# EAGLE design Edzzanine_Base (EAGLE 6.5.0)

## Sheet 1 of 2
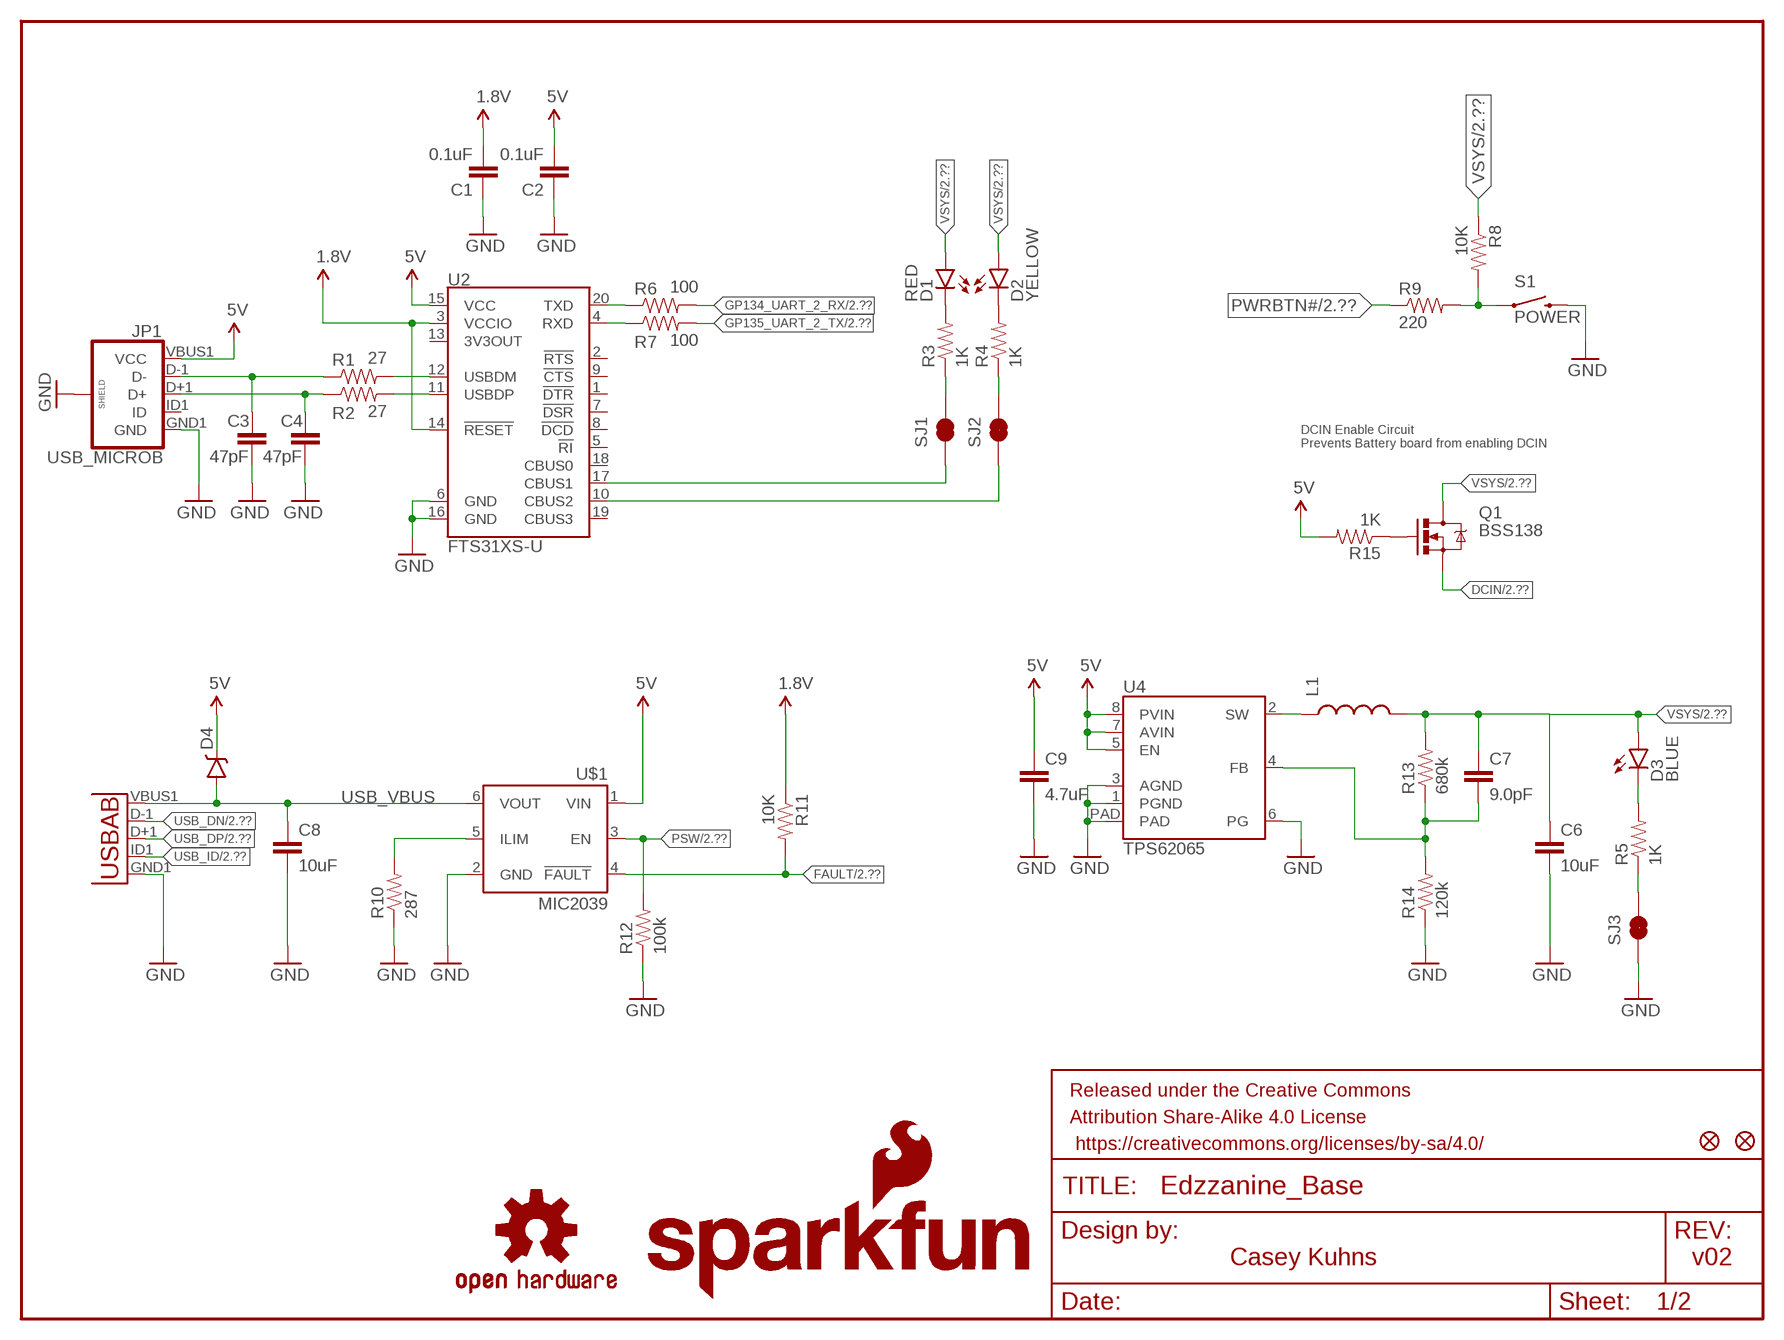
[diagram p0: schematic, sheet 1]

### Parts
C1  0.1uF  0.1UF-25V(+80/-20%)(0603)  [0603-CAP]
C2  0.1uF  0.1UF-25V(+80/-20%)(0603)  [0603-CAP]
C3  47pF  47PF-50V-5%(0603)  [0603-CAP]
C4  47pF  47PF-50V-5%(0603)  [0603-CAP]
C6  10uF  10UF-6.3V-20%(1206)  [1206]
C7  9.0pF  9.0PF-50V-10%(0603)  [0603-CAP]
C8  10uF  10UF-6.3V-20%(1206)  [1206]
C9  4.7uF  4.7UF-6.3V-10%(0603)0603  [0603-CAP]
D1  RED  LED-RED0603  [LED-0603]
D2  YELLOW  LED-YELLOW0603  [LED-0603]
D3  BLUE  LED-BLUE0603  [LED-0603]
D4  DIODE-SCHOTTKY-MBRA140  [SMA-DIODE]
FID1  FIDUCIAL1X2  [FIDUCIAL-1X2]
FID2  FIDUCIAL1X2  [FIDUCIAL-1X2]
FRAME1  FRAME-LETTER  [CREATIVE_COMMONS]
JP1  USB_MICROB  USB_MICROB_PLUGCONN-11752  [USB-B-MICRO-SMD_V03]
L1  INDUCTOR  [INDUCTOR-SRP4020]
LOGO1  SFE_LOGO_NAME_FLAME.1_INCH  [SFE_LOGO_NAME_FLAME_.1]
LOGO4  OSHW-LOGOS  [OSHW-LOGO-S]
Q1  BSS138  MOSFET-NCHANNELBSS138  [SOT23-3]
R1  27  27OHM1/10W1%(0603)  [0603]
R2  27  27OHM1/10W1%(0603)  [0603]
R3  1K  1KOHM1/10W1%(0603)  [0603-RES]
R4  1K  1KOHM1/10W1%(0603)  [0603-RES]
R5  1K  1KOHM1/10W1%(0603)  [0603-RES]
R6  100  100OHM1/10W1%(0603)  [0603-RES]
R7  100  100OHM1/10W1%(0603)  [0603-RES]
R8  10K  10KOHM1/10W1%(0603)0603  [0603-RES]
R9  220  22OHM1/10W1%(0603)  [0603-RES]
R10  287  287OHM-1/10W-1%(0603)  [0603-RES]
R11  10K  10KOHM1/10W1%(0603)0603  [0603-RES]
R12  100k  100KOHM1/10W1%(0603)  [0603-RES]
R13  680k  RESISTOR0603  [0603-RES]
R14  120k  RESISTOR0603  [0603-RES]
R15  1K  1KOHM1/10W1%(0603)  [0603-RES]
S1  POWER  SWITCH-MOMENTARY-2TACTILE-SWITCH-SMD-RIGHT-ANGLE  [TACTILE_SWITCH-SMD-RIGHT-ANGLE]
SJ1  JUMPER-PAD-2-NC_BY_TRACE  [PAD-JUMPER-2-NC_BY_TRACE_YES_SILK]
SJ2  JUMPER-PAD-2-NC_BY_TRACE  [PAD-JUMPER-2-NC_BY_TRACE_YES_SILK]
SJ3  JUMPER-PAD-2-NC_BY_TRACE  [PAD-JUMPER-2-NC_BY_TRACE_YES_SILK]
U2  FTS31XS-U  FT231XS  [SSOP20_L]
U3  USB-ABCONN-11794  [USB-AB-MICRO-SMD_V03]
U4  TPS62065  [WSON-8-PAD]
U$1  MIC2039  [SOT23-6]

### Nets
1.8V: C1.2 R11.1 U2.3(VCCIO) U2.14(!RESET) ; also sheet 2
5V: C2.2 C9.1 D4.C JP1.VBUS1(VCC) R15.2 U2.15(VCC) U4.5(EN) U4.7(AVIN) U4.8(PVIN) U$1.1(VIN)
DCIN: Q1.2(S) ; also sheet 2
FAULT: R11.2 U$1.4(!FAULT) ; also sheet 2
GND: C1.1 C2.1 C3.2 C4.2 C6.2 C8.2 C9.2 JP1.GND1(GND) JP1.SHIELD1(SHIELD) JP1.SHIELD2(SHIELD) JP1.SHIELD3(SHIELD) R10.1 R12.1 R14.1 S1.2 SJ3.1 U2.6(GND) U2.16(GND) U3.GND1(GND) U4.1(PGND) U4.3(AGND) U4.6(PG) U4.PAD U$1.2(GND) ; also sheet 2
GP134_UART_2_RX: R6.2 ; also sheet 2
GP135_UART_2_TX: R7.2 ; also sheet 2
N$1: SJ1.1 U2.17(CBUS1)
N$2: C3.1 JP1.D-1(D-) R1.1
N$3: C4.1 JP1.D+1(D+) R2.1
N$4: R1.2 U2.12(USBDM)
N$5: R2.2 U2.11(USBDP)
N$6: SJ2.1 U2.10(CBUS2)
N$7: R3.1 SJ1.2
N$8: R4.1 SJ2.2
N$9: D1.C R3.2
N$10: D2.C R4.2
N$11: R6.1 U2.20(TXD)
N$12: D3.C R5.2
N$13: R5.1 SJ3.2
N$14: R7.1 U2.4(RXD)
N$15: R8.2 R9.2 S1.1
N$16: R10.2 U$1.5(ILIM)
N$17: C7.2 R13.1 R14.2 U4.4(FB)
N$18: Q1.1(G) R15.1
N$19: L1.P$1 U4.2(SW)
PSW: R12.2 U$1.3(EN) ; also sheet 2
PWRBTN#: R9.1 ; also sheet 2
USB_DN: U3.D-1(D-) ; also sheet 2
USB_DP: U3.D+1(D+) ; also sheet 2
USB_ID: U3.ID1(USBID) ; also sheet 2
USB_VBUS: C8.1 D4.A U3.VBUS1(VBUS) U$1.6(VOUT) ; also sheet 2
VSYS: C6.1 C7.1 D1.A D2.A D3.A L1.P$2 Q1.3(D) R8.1 R13.2 ; also sheet 2
Unconnected: JP1.ID1(ID) U2.1(!DTR) U2.2(!RTS) U2.5(!RI) U2.7(!DSR) U2.8(!DCD) U2.9(!CTS) U2.13(3V3OUT) U2.18(CBUS0) U2.19(CBUS3)

### Notes on the sheet
- DCIN Enable Circuit
  Prevents Battery board from enabling DCIN
- Casey Kuhns | v02

## Sheet 2 of 2
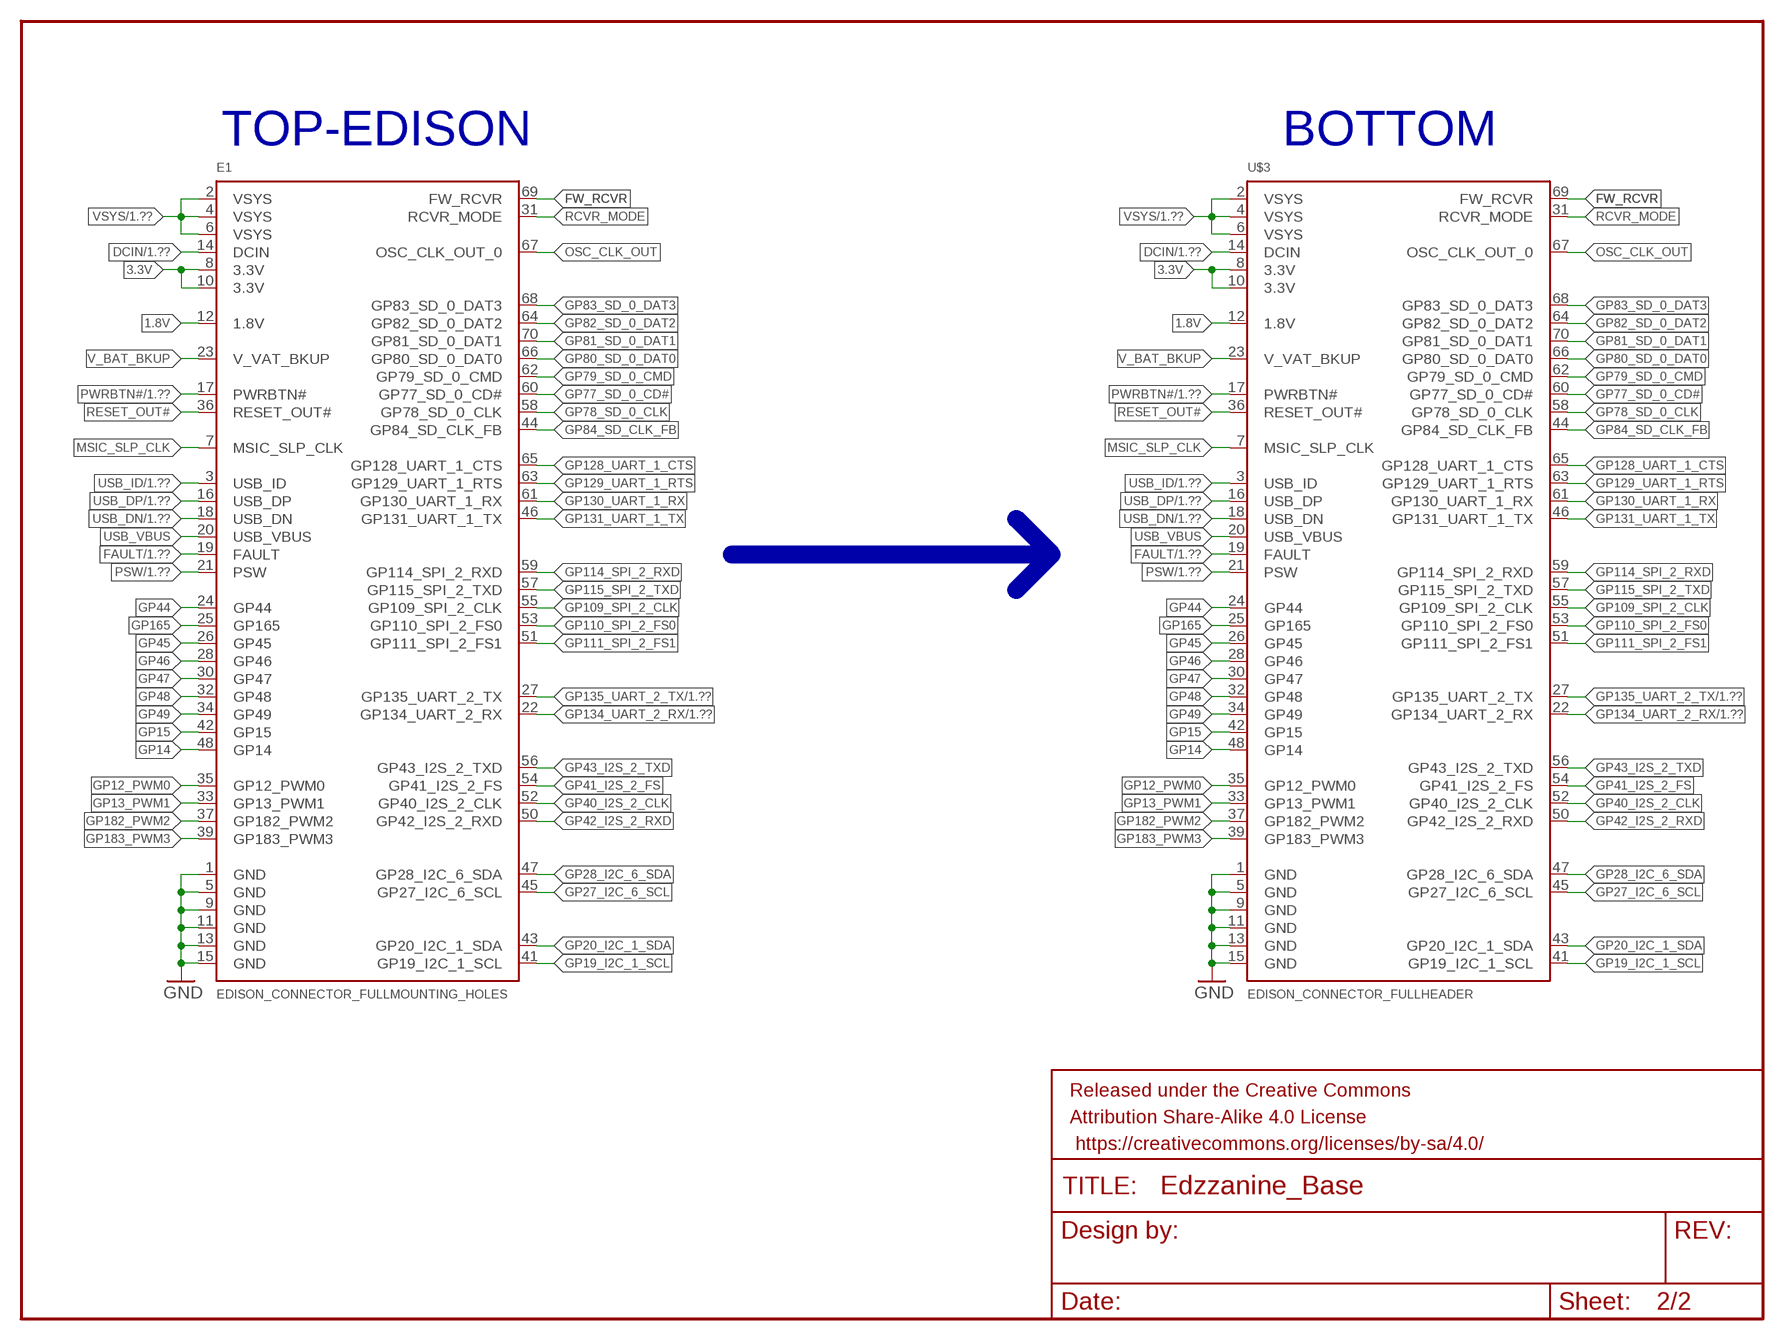
[diagram p1: schematic, sheet 2]

### Parts
E1  EDISON_CONNECTOR_FULLMOUNTING_HOLES  [EDISON_DAUGHTER]
FRAME2  FRAME-LETTER  [CREATIVE_COMMONS]
U$3  EDISON_CONNECTOR_FULLHEADER  [DF40C-70DP-0.4(51)]

### Nets
1.8V: E1.12(1.8V) U$3.12(1.8V) ; also sheet 1
3.3V: E1.8(3.3V) E1.10(3.3V) U$3.8(3.3V) U$3.10(3.3V)
DCIN: E1.14(DCIN) U$3.14(DCIN) ; also sheet 1
FAULT: E1.19(FAULT) U$3.19(FAULT) ; also sheet 1
FW_RCVR: E1.69(FW_RCVR) U$3.69(FW_RCVR)
GND: E1.1(GND) E1.5(GND) E1.9(GND) E1.11(GND) E1.13(GND) E1.15(GND) U$3.1(GND) U$3.5(GND) U$3.9(GND) U$3.11(GND) U$3.13(GND) U$3.15(GND) ; also sheet 1
GP12_PWM0: E1.35(GP12_PWM0) U$3.35(GP12_PWM0)
GP13_PWM1: E1.33(GP13_PWM1) U$3.33(GP13_PWM1)
GP14: E1.48(GP14) U$3.48(GP14)
GP15: E1.42(GP15) U$3.42(GP15)
GP19_I2C_1_SCL: E1.41(GP19_I2C_1_SCL) U$3.41(GP19_I2C_1_SCL)
GP20_I2C_1_SDA: E1.43(GP20_I2C_1_SDA) U$3.43(GP20_I2C_1_SDA)
GP27_I2C_6_SCL: E1.45(GP27_I2C_6_SCL) U$3.45(GP27_I2C_6_SCL)
GP28_I2C_6_SDA: E1.47(GP28_I2C_6_SDA) U$3.47(GP28_I2C_6_SDA)
GP40_I2S_2_CLK: E1.52(GP40_I2S_2_CLK) U$3.52(GP40_I2S_2_CLK)
GP41_I2S_2_FS: E1.54(GP41_I2S_2_FS) U$3.54(GP41_I2S_2_FS)
GP42_I2S_2_RXD: E1.50(GP42_I2S_2_RXD) U$3.50(GP42_I2S_2_RXD)
GP43_I2S_2_TXD: E1.56(GP43_I2S_2_TXD) U$3.56(GP43_I2S_2_TXD)
GP44: E1.24(GP44) U$3.24(GP44)
GP45: E1.26(GP45) U$3.26(GP45)
GP46: E1.28(GP46) U$3.28(GP46)
GP47: E1.30(GP47) U$3.30(GP47)
GP48: E1.32(GP48) U$3.32(GP48)
GP49: E1.34(GP49) U$3.34(GP49)
GP77_SD_0_CD#: E1.60(GP77_SD_0_CD#) U$3.60(GP77_SD_0_CD#)
GP78_SD_0_CLK: E1.58(GP78_SD_0_CLK) U$3.58(GP78_SD_0_CLK)
GP79_SD_0_CMD: E1.62(GP79_SD_0_CMD) U$3.62(GP79_SD_0_CMD)
GP80_SD_0_DAT0: E1.66(GP80_SD_0_DAT0) U$3.66(GP80_SD_0_DAT0)
GP81_SD_0_DAT1: E1.70(GP81_SD_0_DAT1) U$3.70(GP81_SD_0_DAT1)
GP82_SD_0_DAT2: E1.64(GP82_SD_0_DAT2) U$3.64(GP82_SD_0_DAT2)
GP83_SD_0_DAT3: E1.68(GP83_SD_0_DAT3) U$3.68(GP83_SD_0_DAT3)
GP84_SD_CLK_FB: E1.44(GP84_SD_CLK_FB) U$3.44(GP84_SD_CLK_FB)
GP109_SPI_2_CLK: E1.55(GP109_SPI_2_CLK) U$3.55(GP109_SPI_2_CLK)
GP110_SPI_2_FS0: E1.53(GP110_SPI_2_FS0) U$3.53(GP110_SPI_2_FS0)
GP111_SPI_2_FS1: E1.51(GP111_SPI_2_FS1) U$3.51(GP111_SPI_2_FS1)
GP114_SPI_2_RXD: E1.59(GP114_SPI_2_RXD) U$3.59(GP114_SPI_2_RXD)
GP115_SPI_2_TXD: E1.57(GP115_SPI_2_TXD) U$3.57(GP115_SPI_2_TXD)
GP128_UART_1_CTS: E1.65(GP128_UART_1_CTS) U$3.65(GP128_UART_1_CTS)
GP129_UART_1_RTS: E1.63(GP129_UART_1_RTS) U$3.63(GP129_UART_1_RTS)
GP130_UART_1_RX: E1.61(GP130_UART_1_RX) U$3.61(GP130_UART_1_RX)
GP131_UART_1_TX: E1.46(GP131_UART_1_TX) U$3.46(GP131_UART_1_TX)
GP134_UART_2_RX: E1.22(GP134_UART_2_RX) U$3.22(GP134_UART_2_RX) ; also sheet 1
GP135_UART_2_TX: E1.27(GP135_UART_2_TX) U$3.27(GP135_UART_2_TX) ; also sheet 1
GP165: E1.25(GP165) U$3.25(GP165)
GP182_PWM2: E1.37(GP182_PWM2) U$3.37(GP182_PWM2)
GP183_PWM3: E1.39(GP183_PWM3) U$3.39(GP183_PWM3)
MSIC_SLP_CLK: E1.7(MSIC_SLP_CLK) U$3.7(MSIC_SLP_CLK)
OSC_CLK_OUT: E1.67(OSC_CLK_OUT_0) U$3.67(OSC_CLK_OUT_0)
PSW: E1.21(PSW) U$3.21(PSW) ; also sheet 1
PWRBTN#: E1.17(PWRBTN#) U$3.17(PWRBTN#) ; also sheet 1
RCVR_MODE: E1.31(RCVR_MODE) U$3.31(RCVR_MODE)
RESET_OUT#: E1.36(RESET_OUT#) U$3.36(RESET_OUT#)
USB_DN: E1.18(USB_DN) U$3.18(USB_DN) ; also sheet 1
USB_DP: E1.16(USB_DP) U$3.16(USB_DP) ; also sheet 1
USB_ID: E1.3(USB_ID) U$3.3(USB_ID) ; also sheet 1
USB_VBUS: E1.20(USB_VBUS) U$3.20(USB_VBUS) ; also sheet 1
V_BAT_BKUP: E1.23(V_VAT_BKUP) U$3.23(V_VAT_BKUP)
VSYS: E1.2(VSYS) E1.4(VSYS) E1.6(VSYS) U$3.2(VSYS) U$3.4(VSYS) U$3.6(VSYS) ; also sheet 1

### Buses
B$1

### Notes on the sheet
- TOP-EDISON | BOTTOM

## Library data of the parts
C1 C2 = SparkFun-Capacitors:0.1UF-25V(+80/-20%)(0603): CAP-00810 Ceramic Standard decoupling cap; PROD_ID: CAP-00810
C3 C4 = SparkFun-Capacitors:47PF-50V-5%(0603): CAP-08913; PROD_ID: CAP-08913
C6 C8 = SparkFun-Capacitors:10UF-6.3V-20%(1206): CAP-10057 Ceramic; PROD_ID: CAP-10057
C7 = SparkFun-Capacitors:9.0PF-50V-10%(0603): CAP-09341; PROD_ID: CAP-09341
C9 = SparkFun-Capacitors:4.7UF-6.3V-10%(0603): CAP-08280; PROD_ID: CAP-08280
D1 = SparkFun-LED:LED-RED: Assorted Red LEDs LilyPad 1206- DIO-09912 1206- DIO-00809 0603- DIO-00819; PROD_ID: DIO-00819
D2 = SparkFun-LED:LED-YELLOW: Yellow SMD LEDs LilyPad 1206- DIO-09909 0603- DIO-09003; PROD_ID: DIO-09003
D3 = SparkFun-LED:LED-BLUE: Blue LEDs for production use Various blue LEDs stocked by SparkFun production 0603 - DIO-08575 Rebel - DIO-09553 1206 - DIO-09911; PROD_ID: DIO-08575
D4 = SparkFun-DiscreteSemi:DIODE-SCHOTTKY: Schottky diodes in SFE's production catalog BAT20J 1A 23V 0.62Vf RB751 120mA 40V 0.37Vf PMEG4005EJ 0.5A 40V 0.42Vf MBRA140 1A 40V 0.5Vf B340A 3A 40V SMA; PROD_ID: DIO-08053; VALUE: MBRA140
E1 U$3 = Edison:EDISON_CONNECTOR_FULL
FID1 FID2 = SparkFun-Aesthetics:FIDUCIAL: Fiducial Alignment Points Various fiducial points for machine vision alignment.
FRAME1 FRAME2 = SparkFun-Aesthetics:FRAME-LETTER: Schematic Frame Standard 8.5x11 US Letter frame
JP1 = SparkFun-Connectors:USB_MICROB_PLUG: USB Micro-B connectors Some male, some female. Watch your step!; PROD_ID: CONN-11752
L1 = SparkFun-Passives:INDUCTOR: Inductors Basic Inductor/Choke - 0603 and 1206. Footprints are not proven and vary greatly between part numbers. SRN6045- 33uH, 20% 1.4A SDR0403-560KL - 56uH, 10%, 500mA RMS/740mA peak
LOGO1 = SparkFun-Aesthetics:SFE_LOGO_NAME_FLAME: SFE Logo, name and flame This is the SparkFun full logo. The logo on the schematic will always be the same size; the package variant is the height of the flame part of the logo. Default layer for the logo on the board is tSilk.
LOGO4 = SparkFun-Aesthetics:OSHW-LOGO: Open Source Hardware Logo This logo indicates the piece of hardware it is found on incorporates a OSHW license and/or adheres to the definition of open source hardware found here: http://freedomdefined.org/OSHW
Q1 = SparkFun-DiscreteSemi:MOSFET-NCHANNEL: Common NMOSFET Parts MFG P/N Store ID Prod ID FDD8780 TRANS-09984 SI7820DN TRANS-11055 FDS6630A IC-08089 2N7002PW TRANS-11151 FQP30N06L COM-10213 TRANS-10060 BSS123LT1G TRANS-08345 BSS138 TRANS-00830 BS170 2N7000; PROD_ID: TRANS-00830
R1 R2 = SparkFun-Resistors:27OHM1/10W1%(0603): RES-09334; PROD_ID: RES-09334
R3-R5 R15 = SparkFun-Resistors:1KOHM1/10W1%(0603): RES-07856; PROD_ID: RES-07856
R6 R7 = SparkFun-Resistors:100OHM1/10W1%(0603): RES-07863; PROD_ID: RES-07863
R8 R11 = SparkFun-Resistors:10KOHM1/10W1%(0603): RES-00824; PROD_ID: RES-00824
R9 = SparkFun-Resistors:22OHM1/10W1%(0603): RES-08698; PROD_ID: RES-08698; VALUE: 22
R10 = SparkFun-Resistors:287OHM-1/10W-1%(0603): RES-10752; PROD_ID: RES-10752
R12 = SparkFun-Resistors:100KOHM1/10W1%(0603): RES-07828; PROD_ID: RES-07828
R13 R14 = SparkFun-Resistors:RESISTOR: Resistor Basic schematic elements and footprints for 0603, 1206, and PTH resistors.
S1 = SparkFun-Electromechanical:SWITCH-MOMENTARY-2: Various NO switches- pushbuttons, reed, etc; PROD_ID: COMP-12265
SJ1-SJ3 = SparkFun-Passives:JUMPER-PAD-2-NC_BY_TRACE
U2 = SparkFun-DigitalIC:FT231X: FTDI FT231X Full Speed USB to Full-handshake UART This USB2.0 Full Speed IC offers a compact bridge to full handshake UART interfaces. The device is a UART, capable of operating up to 3MBaud, with low power consumption (8mA). The FT231X includes the complete FT-X series feature set and enables USB to be added into a system design quickly and easily over a UART interface.; PROD_ID: IC-11524
U3 = SparkFun-Connectors:USB-AB: This is a USB AB connector that is compatible with USB OTG. i.e. this connector can serve as a host or device; PROD_ID: CONN-11794
U4 = Testing:TPS62065: Texas Instruments TPS62172 3-17V 0.5A Step-Down Converter with DCS control. Available in adjustable and fixed output voltage versions. Is packaged in an 8-pin WSON package measuring 2 × 2 mm (DSG). See a 3.3V fixed output version of this chip in action on the Electric Imp Breakout Board <https://www.sparkfun.com/products/11400>. Datasheet <http://www.ti.com/lit/gpn/tps62172>
U$1 = Testing:MIC2039

## Board
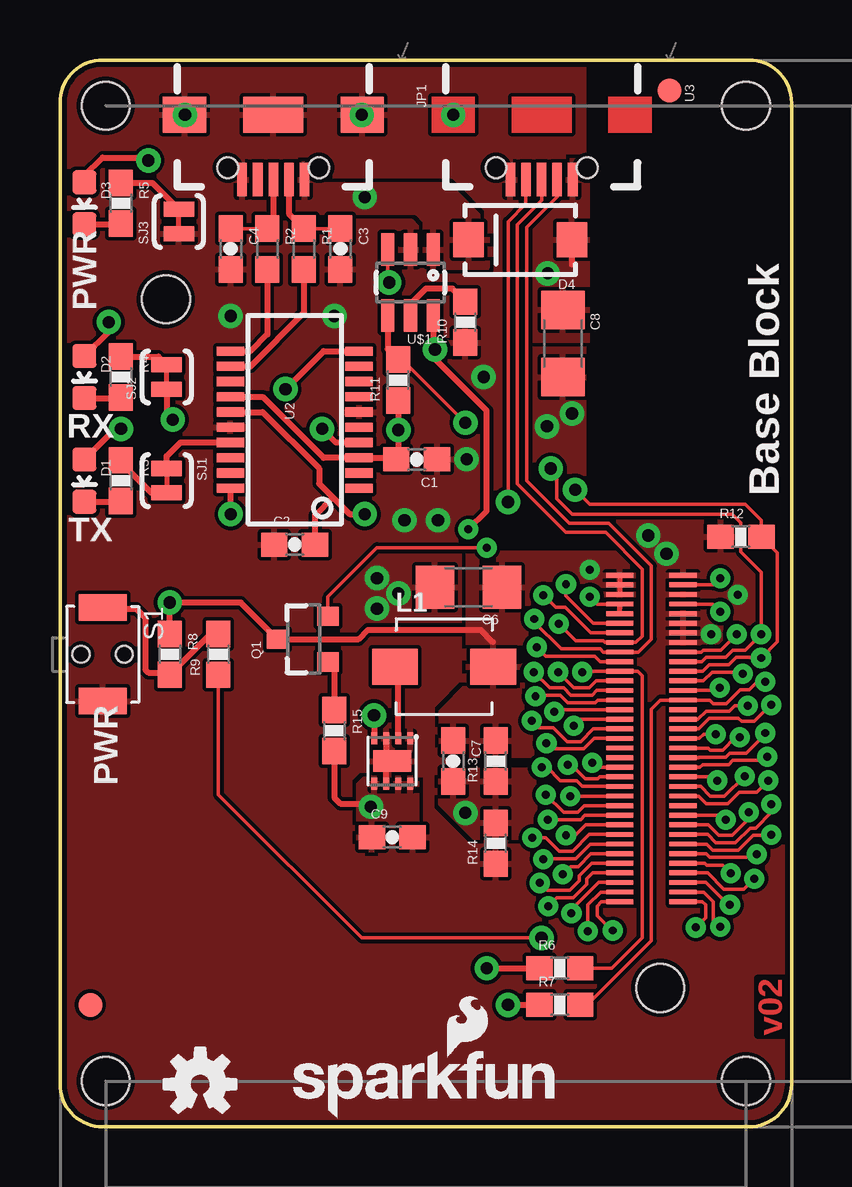
[diagram p2: board, top side]
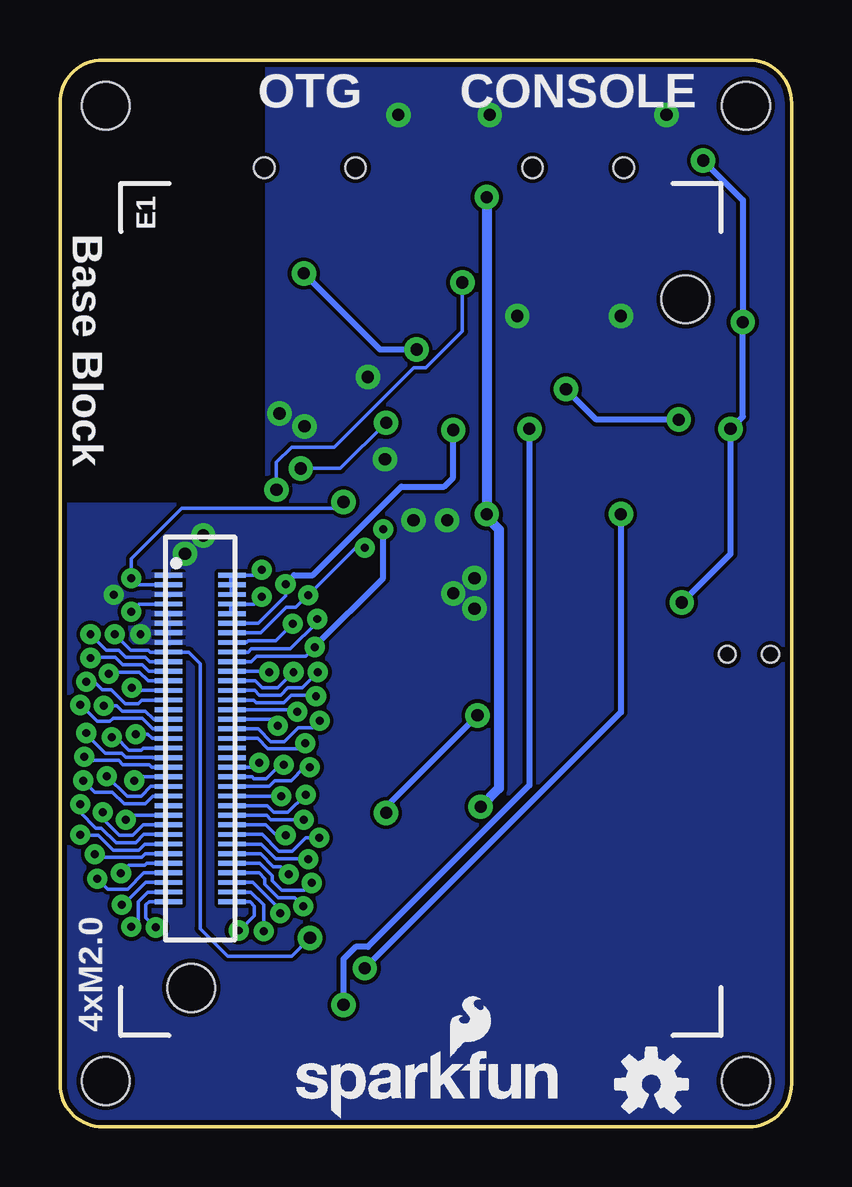
[diagram p3: board, bottom side, seen from below]

Size 30.48 x 44.45 mm. Coordinates in mm from the lower left corner, seen from the top.
Outline: 30.48,42.67 30.48,1.78 arc-90 28.7,0 1.78,0 arc-90 0,1.78 0,42.67 arc-90 1.78,44.45 28.7,44.45 arc-90 30.48,42.67
Copper layers (1*16): Top 0.035mm / dielectric 1.5mm / Bottom 0.035mm
Design rules "SparkFun-2-layer *": minimum track width 6mil, minimum drill 13mil, track to track 6mil, track to pad 6mil, pad to pad 6mil, via to via 6mil, smd to smd 6mil, copper to edge 8mil, drill to drill 8mil, minimum pad ring 12mil, minimum via ring 10mil, stop-mask expansion 4mil, vias tented up to drill 20mil, thermal gap 6mil
Holes 2 mm at 28.57,1.91 1.91,1.91 1.91,42.55 28.57,42.55
tRestrict: area 22.1,26.2 to 30.5,44.5
bRestrict: area 22.1,26.2 to 30.5,44.5

### Footprints (pad centres in the part's own frame; a part is rotated, then mirrored left to right if it is on the bottom)
0603-CAP = smd 1.1 x 1: 1 -0.85,0; 2 0.85,0
1206 = smd 1.6 x 1.8: 1 -1.4,0; 2 1.4,0
LED-0603 = smd 1 x 1: A 0,-0.877; C 0,0.877
SMA-DIODE = smd 1.27 x 1.47: A -2.15,0; C 2.15,0
EDISON_DAUGHTER = smd 1.14 x 0.2: 1 1.98,19.17; 2 4.62,19.17; 3 1.98,18.77; 4 4.62,18.77; 5 1.98,18.37; 6 4.62,18.37; 7 1.98,17.97; 8 4.62,17.97; 9 1.98,17.57; 10 4.62,17.57; 11 1.98,17.17; 12 4.62,17.17; 13 1.98,16.77; 14 4.62,16.77; 15 1.98,16.37; 16 4.62,16.37; 17 1.98,15.97; 18 4.62,15.97; 19 1.98,15.57; 20 4.62,15.57; 21 1.98,15.17; 22 4.62,15.17; 23 1.98,14.77; 24 4.62,14.77; 25 1.98,14.37; 26 4.62,14.37; 27 1.98,13.97; 28 4.62,13.97; 29 1.98,13.57; 30 4.62,13.57; 31 1.98,13.17; 32 4.62,13.17; 33 1.98,12.77; 34 4.62,12.77; 35 1.98,12.37; 36 4.62,12.37; 37 1.98,11.97; 38 4.62,11.97; 39 1.98,11.57; 40 4.62,11.57; 41 1.98,11.17; 42 4.62,11.17; 43 1.98,10.77; 44 4.62,10.77; 45 1.98,10.37; 46 4.62,10.37; 47 1.98,9.97; 48 4.62,9.97; 49 1.98,9.57; 50 4.62,9.57; 51 1.98,9.17; 52 4.62,9.17; 53 1.98,8.77; 54 4.62,8.77; 55 1.98,8.37; 56 4.62,8.37; 57 1.98,7.97; 58 4.62,7.97; 59 1.98,7.57; 60 4.62,7.57; 61 1.98,7.17; 62 4.62,7.17; 63 1.98,6.77; 64 4.62,6.77; 65 1.98,6.37; 66 4.62,6.37; 67 1.98,5.97; 68 4.62,5.97; 69 1.98,5.57; 70 4.62,5.57 | hole 2: 23.53,30.67; 2.93,1.98
FIDUCIAL-1X2 = smd 1 x 1: 1 0,0
USB-B-MICRO-SMD_V03 = smd 1.4 x 0.4: D+1 2.7,0; D-1 2.7,0.65; GND1 2.7,-1.3; ID1 2.7,-0.65; VBUS1 2.7,1.3 | smd 1.5 x 1.8: SHIELD1 0,3.7; SHIELD2 0,-3.7 | smd 1.5 x 2.5: SHIELD3 0,0 | hole 0.85: 2.2,1.9; 2.2,-1.9
INDUCTOR-SRP4020 = smd 1.9 x 1.5: P$1 -2.05,0; P$2 2.05,0
SOT23-3 = smd 0.8 x 0.9: 1 -0.95,-1; 2 0.95,-1; 3 0,1.1
0603 = smd 1.1 x 1: 1 -0.85,0; 2 0.85,0
0603-RES = smd 1.1 x 1: 1 -0.85,0; 2 0.85,0
TACTILE_SWITCH-SMD-RIGHT-ANGLE = smd 1.1 x 2: 1 -1.95,0; 2 1.95,0 | hole 0.7: 0,0.9; 0,-0.9
PAD-JUMPER-2-NC_BY_TRACE_YES_SILK = smd 0.635 x 1.27: 1 -0.508,0; 2 0.508,0
SSOP20_L = smd 0.381 x 1.143: 1 -2.857,-2.68; 2 -2.223,-2.68; 3 -1.587,-2.68; 4 -0.953,-2.68; 5 -0.318,-2.68; 6 0.318,-2.68; 7 0.953,-2.68; 8 1.587,-2.68; 9 2.223,-2.68; 10 2.857,-2.68; 11 2.857,2.68; 12 2.223,2.68; 13 1.587,2.68; 14 0.953,2.68; 15 0.318,2.68; 16 -0.318,2.68; 17 -0.953,2.68; 18 -1.587,2.68; 19 -2.223,2.68; 20 -2.857,2.68
USB-AB-MICRO-SMD_V03 = smd 1.4 x 0.4: D+1 2.7,0; D-1 2.7,0.65; GND1 2.7,-1.3; ID1 2.7,-0.65; VBUS1 2.7,1.3 | hole 0.85: 2.2,1.9; 2.2,-1.9
WSON-8-PAD = smd 0.25 x 0.5: 1 -0.75,-0.95; 2 -0.25,-0.95; 3 0.25,-0.95; 4 0.75,-0.95; 5 0.75,0.95; 6 0.25,0.95; 7 -0.25,0.95; 8 -0.75,0.95 | smd 1.6 x 0.9: PAD 0,0
SOT23-6 = smd 0.55 x 1.35: 1 -0.95,-1.375; 2 0,-1.375; 3 0.95,-1.375; 4 0.95,1.375; 5 0,1.375; 6 -0.95,1.375
DF40C-70DP-0.4(51) = smd 0.2 x 1.14 bottom: 1 6.8,1.32; 2 6.8,-1.32; 3 6.4,1.32; 4 6.4,-1.32; 5 6,1.32; 6 6,-1.32; 7 5.6,1.32; 8 5.6,-1.32; 9 5.2,1.32; 10 5.2,-1.32; 11 4.8,1.32; 12 4.8,-1.32; 13 4.4,1.32; 14 4.4,-1.32; 15 4,1.32; 16 4,-1.32; 17 3.6,1.32; 18 3.6,-1.32; 19 3.2,1.32; 20 3.2,-1.32; 21 2.8,1.32; 22 2.8,-1.32; 23 2.4,1.32; 24 2.4,-1.32; 25 2,1.32; 26 2,-1.32; 27 1.6,1.32; 28 1.6,-1.32; 29 1.2,1.32; 30 1.2,-1.32; 31 0.8,1.32; 32 0.8,-1.32; 33 0.4,1.32; 34 0.4,-1.32; 35 0,1.32; 36 0,-1.32; 37 -0.4,1.32; 38 -0.4,-1.32; 39 -0.8,1.32; 40 -0.8,-1.32; 41 -1.2,1.32; 42 -1.2,-1.32; 43 -1.6,1.32; 44 -1.6,-1.32; 45 -2,1.32; 46 -2,-1.32; 47 -2.4,1.32; 48 -2.4,-1.32; 49 -2.8,1.32; 50 -2.8,-1.32; 51 -3.2,1.32; 52 -3.2,-1.32; 53 -3.6,1.32; 54 -3.6,-1.32; 55 -4,1.32; 56 -4,-1.32; 57 -4.4,1.32; 58 -4.4,-1.32; 59 -4.8,1.32; 60 -4.8,-1.32; 61 -5.2,1.32; 62 -5.2,-1.32; 63 -5.6,1.32; 64 -5.6,-1.32; 65 -6,1.32; 66 -6,-1.32; 67 -6.4,1.32; 68 -6.4,-1.32; 69 -6.8,1.32; 70 -6.8,-1.32

### Placement (x,y rotation side)
C1  14.86,27.81 180 top
C2  9.78,24.26 0 top
C3  11.68,36.58 270 top
C4  7.11,36.58 270 top
C6  17.02,22.48 180 top
C7  16.38,15.24 270 top
C8  20.95,32.64 270 top
C9  13.84,12.06 0 top
D1  1.02,26.92 180 top
D2  1.02,31.24 180 top
D3  1.02,38.48 180 top
D4  19.18,36.96 180 top
E1  27.94,3.81 0 bottom
FID1  25.4,43.18 0 top
FID2  1.27,5.08 0 top
FRAME1  -1.27,-13.97 0 top  (outside the outline)
FRAME2  -1.27,-13.97 0 top  (outside the outline)
JP1  8.89,42.16 270 top
L1  16,19.18 0 top
LOGO1  9.27,0.25 0 top
LOGO2  OSHW-LOGOS  [OSHW-LOGO-S]  5.84,1.78 0 bottom
LOGO3  SFE_LOGO_NAME_FLAME.1_INCH  [SFE_LOGO_NAME_FLAME_.1]  21.08,0.25 0 bottom
LOGO4  5.84,1.78 0 top
Q1  10.16,20.32 90 top
R1  10.16,36.58 270 top
R2  8.64,36.58 270 top
R3  2.54,26.92 270 top
R4  2.54,31.24 270 top
R5  2.54,38.48 270 top
R6  20.83,6.6 0 top
R7  20.83,5.08 0 top
R8  4.57,19.68 270 top
R9  6.6,19.68 90 top
R10  16.89,33.53 90 top
R11  14.1,31.11 90 top
R12  28.37,24.59 0 top
R13  18.16,15.24 90 top
R14  18.16,11.81 90 top
R15  11.43,16.51 270 top
S1  1.78,19.68 270 top
SJ1  4.45,26.92 270 top
SJ2  4.45,31.24 90 top
SJ3  4.95,37.72 90 top
U2  9.78,29.46 90 top
U3  20.07,42.16 270 top
U4  13.84,15.24 180 top
U$1  14.61,35.18 180 top
U$3  24.64,16.18 90 bottom

### Tracks (layer width: path | path; a pad name or v marks a point on that pad's centre or on a via)
1.8V  (via drill 0.33, 0.51)
  Top 0.152: U$3.12 22.23,20.98 21.08,22.12 v21.08,22.61 21.08,22.63
  Top 0.254: R11.1 v14.1,29.03 14.1,27.9 C1.2 13.95,27.88 U2.3 10.99,27.88 8.45,30.42 U2.14
  Bottom 0.152: 21.08,22.63 v21.08,22.61 21.08,22.12 22.23,20.98 U$3.12 | U$3.12
  Bottom 0.254: 21.08,22.63 20.73,22.99 19.94,22.99 16.26,26.67 14.48,26.67 14.1,27.05 v14.1,29.03
3.3V  (via drill 0.33)
  Top 0.152: v22.08,22.09 22.39,21.78 U$3.8
  Top 0.2: 23.32,21.58 U$3.8 U$3.10
  Bottom 0.152: U$3.8 | 23.32,21.58 U$3.10 | U$3.10 | v22.08,22.09 22.39,21.78 U$3.8
  Bottom 0.2: U$3.10 U$3.8
5V  (via drill 0.51)
  Top 0.254: U2.15 8.45,29.78 10.79,27.43 10.79,26.8 11.37,26.23 | 11.37,26.23 12.06,25.53 v12.7,25.53 | C2.2 10.63,25.49 11.37,26.23 | R15.2 11.43,13.72 11.68,13.46 12.83,13.46 v12.95,13.34
  Bottom 0.406: v12.7,38.73 v12.7,25.53 12.7,25.4 12.19,24.89 12.19,14.1 v12.95,13.34
  pour Top: 9.91,40.13 10.41,40.13 10.41,39.24 16.13,39.24 17.78,37.59 17.78,35.81 15.24,35.81 15.24,37.72 14.86,38.1 9.91,38.1
  pour Top: 12.45,11.56 13.59,11.56 13.59,12.57 14.86,12.57 14.86,14.61 13.97,14.61 13.97,13.84 13.21,13.84 13.21,14.61 12.83,14.61 12.45,14.22
DCIN  (via drill 0.33)
  Top 0.152: E1.14 22.12,20.58 21.06,21.64 20.65,21.64 v20.14,22.15 | Q1.2 11.16,22.08 13.21,24.13 v17.78,24.13
  Bottom 0.152: E1.14 22.12,20.58 21.06,21.64 20.65,21.64 v20.14,22.15 18.16,24.13 v17.78,24.13
FAULT  (via drill 0.33, 0.51)
  Top 0.152: U$3.19 26.75,19.38 26.92,19.56 27.74,19.56 28.04,19.86 28.55,19.86 v29.21,20.52 29.21,23.11 28.37,23.95 28.37,25.17 28.02,25.53 21.34,25.53 20.7,26.16 20.7,27.18 v20.45,27.43 | R11.2 14.26,31.96 v16.89,29.34
  Top 0.254: U$1.4 13.65,32.41 R11.2
  Bottom 0.152: v29.21,20.52 28.55,19.86 28.04,19.86 27.74,19.56 26.92,19.56 26.75,19.38 U$3.19 | v16.89,29.34 18.8,27.43 v20.45,27.43
FW_RCVR  (via drill 0.33)
  Top 0.152: v26.49,8.31 26.9,8.71 26.9,9.25 26.76,9.38 U$3.69
  Bottom 0.152: U$3.69 26.76,9.38 26.9,9.25 26.9,8.71 v26.49,8.31
GND  (via drill 0.33, 0.51)
  Top 0.254: U4.3 13.59,15.49 U4.PAD 13.59,14.99 U4.6
  other vias: 27.13,20.52 28.24,22.17 16.94,27.81 24.51,24.64 25.27,23.88 21.34,29.72 17.65,31.24 20.29,29.18 7.11,33.78 11.43,33.78 16.38,42.16 12.57,42.16 5.21,42.16 13.21,22.86 13.21,21.59 14.1,22.23 15.75,25.27 14.35,25.27
  pour Bottom (isolate 0.152, rank 6): 30.48,42.67 30.48,1.78 arc-90 28.7,0 1.78,0 arc-90 0,1.78 0,42.67 arc-90 1.78,44.45 28.7,44.45 arc-90
  pour Top (isolate 0.152, rank 6): 30.48,1.73 arc-90 28.75,0 1.78,0 arc-90 0,1.78 0,42.67 arc-90 1.78,44.45 28.7,44.45 arc-90 30.48,42.67
GP12_PWM0  (via drill 0.33)
  Top 0.152: U$3.35 26.64,16.18 26.82,16.36 v27.33,16.36
  Bottom 0.152: v27.33,16.36 26.82,16.36 26.64,16.18 U$3.35 | U$3.35
GP13_PWM1  (via drill 0.33)
  Top 0.152: v29.64,17.58 29.62,17.58 28.93,16.89 28.4,16.89 28.27,17.02 27.05,17.02 26.61,16.58 U$3.33
  Bottom 0.152: U$3.33 26.61,16.58 27.05,17.02 28.27,17.02 28.4,16.89 28.93,16.89 29.62,17.58 v29.64,17.58
GP14  (via drill 0.33)
  Top 0.152: v21.26,13.77 21.27,13.78 U$3.48
  Bottom 0.152: U$3.48 21.27,13.78 v21.26,13.77
GP15  (via drill 0.33)
  Top 0.152: U$3.42 22.36,14.98 v22.17,15.16
  Bottom 0.152: v22.17,15.16 22.36,14.98 U$3.42
GP19_I2C_1_SCL  (via drill 0.33)
  Top 0.152: U$3.41 26.66,14.98 26.77,15.09 27.86,15.09 28.04,15.27 29.31,15.27 v29.46,15.42
  Bottom 0.152: v29.46,15.42 29.31,15.27 28.04,15.27 27.86,15.09 26.77,15.09 26.66,14.98 U$3.41
GP20_I2C_1_SDA  (via drill 0.33)
  Top 0.152: U$3.43 27.23,14.58 v27.38,14.43
  Bottom 0.152: v27.38,14.43 27.23,14.58 U$3.43 | U$3.43
GP27_I2C_6_SCL  (via drill 0.33)
  Top 0.152: v28.52,14.61 27.69,13.77 27.1,13.77 26.69,14.18 U$3.45
  Bottom 0.152: U$3.45 26.69,14.18 27.1,13.77 27.69,13.77 v28.52,14.61
GP28_I2C_6_SDA  (via drill 0.33)
  Top 0.152: U$3.47 26.61,13.78 26.92,13.46 27.81,13.46 28.3,13.95 29.03,13.95 v29.52,14.43
  Bottom 0.152: v29.52,14.43 29.03,13.95 28.3,13.95 27.81,13.46 26.92,13.46 26.61,13.78 U$3.47
GP40_I2S_2_CLK  (via drill 0.33)
  Top 0.152: U$3.52 21.87,12.98 21.69,12.8 v20.32,12.8
  Bottom 0.152: v20.32,12.8 21.69,12.8 21.87,12.98 U$3.52
GP41_I2S_2_FS  (via drill 0.33)
  Top 0.152: v21.08,12.14 21.46,12.14 21.9,12.58 U$3.54
  Bottom 0.152: U$3.54 21.9,12.58 21.46,12.14 v21.08,12.14
GP42_I2S_2_RXD  (via drill 0.33)
  Top 0.152: U$3.50 21.84,13.38 21.57,13.11 20.98,13.11 v20.24,13.84
  Bottom 0.152: v20.24,13.84 20.98,13.11 21.57,13.11 21.84,13.38 U$3.50
GP43_I2S_2_TXD  (via drill 0.33)
  Top 0.152: U$3.56 22.06,12.18 21.36,11.48 20.8,11.48 20.24,12.04 v19.68,12.04
  Bottom 0.152: v19.68,12.04 20.24,12.04 20.8,11.48 21.36,11.48 22.06,12.18 U$3.56
GP44  (via drill 0.33)
  Top 0.152: U$3.24 22.34,18.58 22.05,18.29 21.41,18.29 v20.75,18.95
  Bottom 0.152: v20.75,18.95 21.41,18.29 22.05,18.29 22.34,18.58 U$3.24
GP45  (via drill 0.33)
  Top 0.152: v19.74,18.95 20.4,18.29 20.98,18.29 21.29,17.98 22.17,17.98 22.37,18.18 U$3.26
  Bottom 0.152: U$3.26 22.37,18.18 22.17,17.98 21.29,17.98 20.98,18.29 20.4,18.29 v19.74,18.95
GP46  (via drill 0.33)
  Top 0.152: U$3.28 22.4,17.78 22.3,17.68 21.16,17.68 20.85,17.98 19.86,17.98 v19.81,17.93
  Bottom 0.152: v19.81,17.93 19.86,17.98 20.85,17.98 21.16,17.68 22.3,17.68 22.4,17.78 U$3.28
GP47  (via drill 0.33)
  Top 0.152: U$3.30 22.43,17.38 22.43,17.37 20.68,17.37 v20.6,17.3
  Bottom 0.152: v20.6,17.3 20.68,17.37 22.43,17.37 22.43,17.38 U$3.30
GP48  (via drill 0.33)
  Top 0.152: v21.41,16.71 21.68,16.98 U$3.32
  Bottom 0.152: U$3.32 21.68,16.98 v21.41,16.71
GP49  (via drill 0.33)
  Top 0.152: U$3.34 22.22,16.58 21.69,16.05 21.13,16.05 20.55,16.64 19.94,16.64 v19.66,16.92
  Bottom 0.152: v19.66,16.92 19.94,16.64 20.55,16.64 21.13,16.05 21.69,16.05 22.22,16.58 U$3.34
GP77_SD_0_CD#  (via drill 0.33)
  Top 0.152: U$3.60 22.12,11.38 21.59,10.85 21.29,10.85 v20.95,10.52
  Bottom 0.152: v20.95,10.52 21.29,10.85 21.59,10.85 22.12,11.38 U$3.60
GP78_SD_0_CLK  (via drill 0.33)
  Top 0.152: U$3.58 22.09,11.78 21.49,11.18 20.17,11.18 v20.14,11.15
  Bottom 0.152: v20.14,11.15 20.17,11.18 21.49,11.18 22.09,11.78 U$3.58
GP79_SD_0_CMD  (via drill 0.33)
  Top 0.152: U$3.62 22.16,10.98 21.64,10.46 21.64,10.26 21.23,9.86 20.3,9.86 v19.99,10.16
  Bottom 0.152: v19.99,10.16 20.3,9.86 21.23,9.86 21.64,10.26 21.64,10.46 22.16,10.98 U$3.62
GP80_SD_0_DAT0  (via drill 0.33)
  Top 0.152: v21.31,8.89 21.31,9.04 22.45,10.18 U$3.66
  Bottom 0.152: U$3.66 22.45,10.18 21.31,9.04 v21.31,8.89
GP81_SD_0_DAT1  (via drill 0.33)
  Top 0.152: U$3.70 22.56,9.38 22.38,9.2 22.38,8.79 22.99,8.18 v23.04,8.18
  Bottom 0.152: v23.04,8.18 22.99,8.18 22.38,8.79 22.38,9.2 22.56,9.38 U$3.70
GP82_SD_0_DAT2  (via drill 0.33)
  Top 0.152: U$3.64 22.19,10.58 21.95,10.34 21.95,10.11 21.39,9.55 20.7,9.55 v20.34,9.2
  Bottom 0.152: v20.34,9.2 20.7,9.55 21.39,9.55 21.95,10.11 21.95,10.34 22.19,10.58 U$3.64
GP83_SD_0_DAT3  (via drill 0.33)
  Top 0.152: v22,8.15 22,9.25 22.53,9.78 U$3.68
  Bottom 0.152: U$3.68 22.53,9.78 22,9.25 v22,8.15
GP84_SD_CLK_FB  (via drill 0.33)
  Top 0.152: U$3.44 22.48,14.58 22.4,14.5 21.89,14.5 21.31,15.09 v21.16,15.09
  Bottom 0.152: v21.16,15.09 21.31,15.09 21.89,14.5 22.4,14.5 22.48,14.58 U$3.44 | U$3.44
GP109_SPI_2_CLK  (via drill 0.33)
  Top 0.152: U$3.55 26.99,12.18 27.33,11.84 28.14,11.84 28.75,12.45 28.98,12.45 29.64,13.11 v29.64,13.44
  Bottom 0.152: v29.64,13.44 29.64,13.11 28.98,12.45 28.75,12.45 28.14,11.84 27.33,11.84 26.99,12.18 U$3.55
GP110_SPI_2_FS0  (via drill 0.33)
  Top 0.152: v28.7,13.11 28.7,12.83 28.02,12.14 27.46,12.14 27.02,12.58 U$3.53
  Bottom 0.152: U$3.53 27.02,12.58 27.46,12.14 28.02,12.14 28.7,12.83 v28.7,13.11
GP111_SPI_2_FS1  (via drill 0.33)
  Top 0.152: v27.74,12.8 27.56,12.98 U$3.51
  Bottom 0.152: U$3.51 27.56,12.98 v27.74,12.8
GP114_SPI_2_RXD  (via drill 0.33)
  Top 0.152: U$3.59 26.92,11.38 27.08,11.23 28.91,11.23 v29.03,11.35
  Bottom 0.152: U$3.59 26.92,11.38 27.08,11.23 28.91,11.23 v29.03,11.35
GP115_SPI_2_TXD  (via drill 0.33)
  Top 0.152: U$3.57 26.95,11.78 27.2,11.53 28.27,11.53 28.88,12.14 29.62,12.14 v29.64,12.17
  Bottom 0.152: U$3.57 26.95,11.78 27.2,11.53 28.27,11.53 28.88,12.14 29.62,12.14 v29.64,12.17
GP128_UART_1_CTS  (via drill 0.33)
  Top 0.152: U$3.65 26.9,10.18 27.84,9.25 v27.91,9.25
  Bottom 0.152: v27.91,9.25 27.84,9.25 26.9,10.18 U$3.65
GP129_UART_1_RTS  (via drill 0.33)
  Top 0.152: v28.93,10.34 28.5,9.91 27.66,9.91 26.99,10.58 U$3.63
  Bottom 0.152: U$3.63 26.99,10.58 27.66,9.91 28.5,9.91 v28.93,10.34
GP130_UART_1_RX  (via drill 0.33)
  Top 0.152: v27.94,10.57 27.61,10.9 26.95,10.9 26.87,10.98 U$3.61
  Bottom 0.152: U$3.61 26.87,10.98 26.95,10.9 27.61,10.9 v27.94,10.57
GP131_UART_1_TX  (via drill 0.33)
  Top 0.152: U$3.46 22.52,14.18 22.5,14.2 21.77,14.2 21.54,14.43 20.85,14.43 20.3,14.99 v20.07,14.99
  Bottom 0.152: v20.07,14.99 20.3,14.99 20.85,14.43 21.54,14.43 21.77,14.2 22.5,14.2 22.52,14.18 U$3.46
GP134_UART_2_RX  (via drill 0.33)
  Top 0.152: v21.77,18.95 21.8,18.98 U$3.22 24.07,18.98 24.26,18.8 24.26,7.87 22.99,6.6 R6.2
  Bottom 0.152: U$3.22 21.8,18.98 v21.77,18.95
GP135_UART_2_TX  (via drill 0.33)
  Top 0.152: v29.39,18.54 29.06,18.54 28.73,18.21 28.35,18.21 27.76,17.63 27.23,17.63 27.08,17.78 U$3.27 25.02,17.78 24.64,17.4 24.64,7.75 21.97,5.08 R7.2
  Bottom 0.152: U$3.27 27.08,17.78 27.23,17.63 27.76,17.63 28.35,18.21 28.73,18.21 29.06,18.54 v29.39,18.54
GP165  (via drill 0.33)
  Top 0.152: v27.48,18.29 27.38,18.18 U$3.25
  Bottom 0.152: U$3.25 27.38,18.18 v27.48,18.29
GP182_PWM2  (via drill 0.33)
  Top 0.152: U$3.37 27.02,15.78 27.1,15.7 27.61,15.7 28.14,16.23 v28.32,16.23
  Bottom 0.152: v28.32,16.23 28.14,16.23 27.61,15.7 27.1,15.7 27.02,15.78 U$3.37
GP183_PWM3  (via drill 0.33)
  Top 0.152: v29.39,16.41 29.39,16.36 28.6,15.57 27.91,15.57 27.74,15.39 26.62,15.39 26.61,15.38 U$3.39
  Bottom 0.152: U$3.39 26.61,15.38 26.62,15.39 27.74,15.39 27.91,15.57 28.6,15.57 29.39,16.36 v29.39,16.41
MSIC_SLP_CLK  (via drill 0.33)
  Top 0.152: v27.51,21.46 27.19,21.78 U$3.7
  Bottom 0.152: U$3.7 27.19,21.78 v27.51,21.46
N$1
  Top 0.254: U2.17 5.02,28.51 4.45,27.94 SJ1.1
N$2
  Top 0.152: R1.1 C3.1
  Top 0.254: JP1.D-1 9.54,38.05 R1.1
N$3
  Top 0.152: R2.1 C4.1
  Top 0.254: JP1.D+1 8.89,37.68 R2.1
N$4
  Top 0.254: U2.12 7.94,31.69 10.16,33.91 R1.2
N$5
  Top 0.254: R2.2 8.64,33.02 7.94,32.32 U2.11
N$6  (via drill 0.51)
  Top 0.254: v9.4,30.73 10.99,32.32 U2.10 | SJ2.1 4.45,29.72 v4.7,29.46
  Bottom 0.254: v4.7,29.46 8.13,29.46 v9.4,30.73
N$7
  Top 0.254: R3.1 2.54,27.69 3.81,26.42 SJ1.2
N$8
  Top 0.254: R4.1 4.1,32.09 SJ2.2
N$9
  Top 0.254: D1.C 2.51,26.05 R3.2
N$10
  Top 0.254: D2.C 2.51,30.36 R4.2
N$11  (via drill 0.51)
  Top 0.254: U2.20 v7.1,25.54 v7.11,25.53 | v17.78,6.6 R6.1
  Bottom 0.254: v7.11,25.53 7.11,17.27 v17.78,6.6
N$12
  Top 0.254: D3.C 2.51,37.6 R5.2
N$13
  Top 0.254: R5.1 3.85,39.33 SJ3.2
N$14  (via drill 0.51)
  Top 0.254: U2.4 11.49,28.51 v10.92,29.08 | v18.67,5.08 R7.1
  Bottom 0.254: v10.92,29.08 10.92,14.22 17.65,7.49 18.16,7.49 18.67,6.99 v18.67,5.08
N$15
  Top 0.254: R9.2 6.27,20.54 R8.2 4.48,18.92 3.68,18.92 3.56,19.05 3.56,21.21 3.17,21.59 1.82,21.59 S1.1
N$16
  Top 0.254: R10.2 16.34,34.92 15.24,34.92 14.61,34.29 U$1.5
N$17  (via drill 0.51)
  Top 0.254: v13.08,17.14 13.09,17.13 U4.4
  Bottom 0.254: v16.89,13.08 16.89,13.34 v13.08,17.14
  pour Top: 15.88,14.86 20.07,14.86 20.07,12.06 17.27,12.06 15.88,13.46
N$18
  Top 0.254: Q1.1 11.43,19.1 R15.1
N$19
  Top 0.254: U4.2 14.09,19.04 L1.P$1
OSC_CLK_OUT  (via drill 0.33)
  Top 0.152: v27.51,8.33 27.23,8.61 27.23,9.37 26.82,9.78 U$3.67
  Bottom 0.152: U$3.67 26.82,9.78 27.23,9.37 27.23,8.61 v27.51,8.33
PSW  (via drill 0.33, 0.51)
  Top 0.152: U$3.21 26.78,18.98 27.05,19.25 27.86,19.25 28.17,19.56 29.18,19.56 v29.21,19.53 29.9,20.22 29.9,23.91 R12.2 29.21,25.27 28.55,25.93 22.07,25.93 v21.46,26.54 | v13.72,35.18 13.65,35.24 U$1.3
  Bottom 0.152: U$3.21 26.78,18.98 27.05,19.25 27.86,19.25 28.17,19.56 29.18,19.56 v29.21,19.53 | v21.46,26.54 21.46,27.69 20.83,28.32 19.05,28.32 15.75,31.62 15.24,31.62 13.72,33.15 v13.72,35.18
PWRBTN#  (via drill 0.33, 0.51)
  Top 0.152: v28.19,20.52 27.53,19.86 26.8,19.86 26.71,19.78 U$3.17 | v20.07,7.87 12.57,7.87 6.6,13.84 R9.1
  Top 0.254: 6.69,18.84 R9.1
  Bottom 0.152: v28.19,20.52 27.53,19.86 26.8,19.86 26.71,19.78 U$3.17 25.11,19.78 24.64,19.3 24.64,8.26 23.5,7.11 20.83,7.11 v20.07,7.87
RCVR_MODE  (via drill 0.33)
  Top 0.152: v28.65,17.55 28.12,17.55 27.89,17.32 26.92,17.32 26.58,16.98 U$3.31
  Bottom 0.152: U$3.31 26.58,16.98 26.92,17.32 27.89,17.32 28.12,17.55 v28.65,17.55
RESET_OUT#  (via drill 0.33)
  Top 0.152: U$3.36 22.25,16.18 21.82,15.75 20.5,15.75 v20.27,15.98
  Bottom 0.152: v20.27,15.98 20.5,15.75 21.82,15.75 22.25,16.18 U$3.36
USB_DN  (via drill 0.33)
  Top 0.152: 22.64,19.78 | 22.64,19.78 22.5,19.91 20.88,19.91 19.76,21.03 v19.76,21.16 | 22.73,19.78 U$3.18 24.1,19.78 24.64,20.32 24.64,23.37 22.86,25.15 21.21,25.15 19.45,26.91 19.45,37.48 20.72,38.75 U3.D-1 | 22.73,19.78 | 22.73,19.78 22.64,19.78
  Bottom 0.152: U$3.18 22.64,19.78 22.5,19.91 20.88,19.91 19.76,21.03 v19.76,21.16
USB_DP  (via drill 0.33)
  Top 0.152: v20.78,20.95 21.49,20.24 22.63,20.24 22.7,20.18 U$3.16 23.99,20.18 24.26,20.45 24.26,23.24 22.73,24.77 21.08,24.77 19.05,26.8 19.05,37.59 20.07,38.61 U3.D+1
  Bottom 0.152: U$3.16 22.7,20.18 22.63,20.24 21.49,20.24 v20.78,20.95
USB_ID  (via drill 0.33, 0.51)
  Top 0.152: v27.51,22.86 27.23,22.58 U$3.3 | v18.67,26.04 18.67,37.72 19.42,38.47 U3.ID1
  Bottom 0.152: U$3.3 27.23,22.58 v27.51,22.86 27.51,23.67 25.4,25.78 18.92,25.78 v18.67,26.04
USB_VBUS  (via drill 0.33, 0.51)
  Top 0.152: v19.86,19.99 20.24,19.61 22.28,19.61 22.5,19.38 U$3.20
  Top 0.254: U$1.6 15.55,32.45 v15.62,32.38 15.62,32 17.78,29.84 17.78,25.65 v17.02,24.89 | D4.A 21.33,35.93
  Bottom 0.152: U$3.20 22.5,19.38 22.28,19.61 20.24,19.61 v19.86,19.99 19.86,20.02
  Bottom 0.254: v15.62,32.38 17.14,32.38 v20.32,35.56 | 19.86,20.02 17.02,22.86 v17.02,24.89
  pour Top: 19.56,40.26 21.97,40.26 21.97,32.77 19.56,32.77
V_BAT_BKUP  (via drill 0.33)
  Top 0.152: v28.45,18.87 28.37,18.95 27.18,18.95 26.81,18.58 U$3.23
  Bottom 0.152: U$3.23 26.81,18.58 27.18,18.95 28.37,18.95 v28.45,18.87
VSYS  (via drill 0.33, 0.51)
  Top 0.2: U$3.4 U$3.2 U$3.4 | U$3.4 U$3.6
  Top 0.254: D3.A 1.02,39.62 1.78,40.39 3.56,40.39 v3.68,40.26 | v2.03,33.53 2.03,33.13 D2.A | D1.A 2.3,29.08 v2.54,29.08 | R8.1 v4.57,21.84 7.54,21.84 Q1.3 12.45,20.32 12.83,20.7 17.53,20.7 18.03,20.19
  Bottom 0.152: U$3.2 22.32,22.98 v22.08,23.21
  Bottom 0.2: U$3.6 U$3.4 U$3.2
  Bottom 0.254: v3.68,40.26 2.03,38.61 v2.03,33.53 2.03,29.59 v2.54,29.08 2.54,23.88 v4.57,21.84
  pour Top: 15.88,15.49 20.07,15.49 20.07,21.46 20.7,22.1 23.88,22.1 23.88,23.88 17.02,23.88 17.02,18.41 15.88,17.27

### Text on the board
Top: v02
tPlace: PWR | RX | Base Block | TX | PWR
bPlace: CONSOLE | OTG | Base Block | 4xM2.0
tDocu: NOTE: Units are in Inches | Casey Kuhns